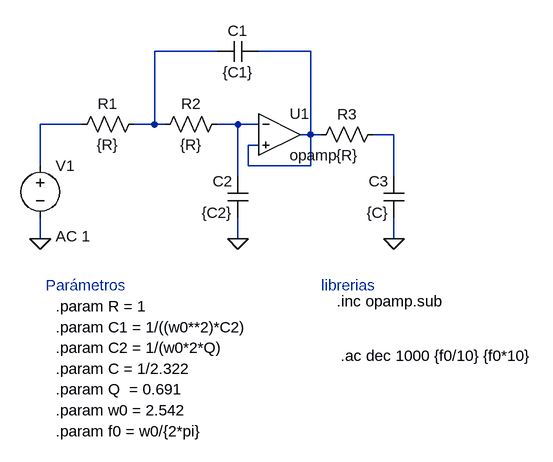
[diagram p0: schematic Draft2.asc]
Draft2.asc, the LTspice schematic file:
Version 4
SHEET 1 880 680
WIRE 192 32 96 32
WIRE 336 32 256 32
WIRE -16 144 -80 144
WIRE 96 144 96 32
WIRE 96 144 64 144
WIRE 112 144 96 144
WIRE 224 144 192 144
WIRE 256 144 224 144
WIRE 336 160 336 32
WIRE 336 160 320 160
WIRE 352 160 336 160
WIRE 464 160 432 160
WIRE 256 176 240 176
WIRE -80 208 -80 144
WIRE 240 208 240 176
WIRE 336 208 336 160
WIRE 336 208 240 208
WIRE 224 224 224 144
WIRE 464 224 464 160
WIRE -80 320 -80 288
WIRE 224 320 224 288
WIRE 464 320 464 288
FLAG -80 320 0
FLAG 224 320 0
FLAG 464 320 0
SYMBOL OpAmps\\opamp 288 96 R0
SYMATTR InstName U1
SYMBOL res 80 128 R90
WINDOW 0 0 56 VBottom 2
WINDOW 3 32 56 VTop 2
SYMATTR InstName R1
SYMATTR Value {R}
SYMBOL res 208 128 R90
WINDOW 0 0 56 VBottom 2
WINDOW 3 32 56 VTop 2
SYMATTR InstName R2
SYMATTR Value {R}
SYMBOL cap 256 16 R90
WINDOW 0 0 32 VBottom 2
WINDOW 3 32 32 VTop 2
SYMATTR InstName C1
SYMATTR Value {C1}
SYMBOL cap 240 288 R180
WINDOW 0 24 56 Left 2
WINDOW 3 24 8 Left 2
SYMATTR InstName C2
SYMATTR Value {C2}
SYMBOL cap 480 288 R180
WINDOW 0 24 56 Left 2
WINDOW 3 24 8 Left 2
SYMATTR InstName C3
SYMATTR Value {C}
SYMBOL res 448 144 R90
WINDOW 0 0 56 VBottom 2
WINDOW 3 32 56 VTop 2
SYMATTR InstName R3
SYMATTR Value {R}
SYMBOL voltage -80 192 R0
WINDOW 123 24 124 Left 2
WINDOW 39 0 0 Left 0
SYMATTR InstName V1
SYMATTR Value ""
SYMATTR Value2 AC 1
TEXT -72 392 Left 2 ;Parámetros
TEXT -56 424 Left 2 !.param R = 1
TEXT -56 456 Left 2 !.param C1 = 1/((w0**2)*C2)
TEXT -56 488 Left 2 !.param C2 = 1/(w0*2*Q)
TEXT -56 520 Left 2 !.param C = 1/2.322
TEXT 382 500 Left 2 !.ac dec 1000 {f0/10} {f0*10}
TEXT 352 392 Left 2 ;librerias
TEXT 376 416 Left 2 !.inc opamp.sub
TEXT -56 552 Left 2 !.param Q  = 0.691
TEXT -56 584 Left 2 !.param w0 = 2.542
TEXT -56 616 Left 2 !.param f0 = w0/{2*pi}

The netlist it stands for:
* Draft2.asc
XU1 N004 N002 N002 opamp Aol=100K GBW=10Meg  ; pins invin noninvin out
R1 N001 N003 {R}
R2 N004 N001 {R}
C1 N002 N001 {C1}
C2 0 N004 {C2}
C3 0 N005 {C}
R3 N005 N002 {R}
V1 N003 0 AC 1
* Parámetros
.param R = 1
.param C1 = 1/((w0**2)*C2)
.param C2 = 1/(w0*2*Q)
.param C = 1/2.322
.ac dec 1000 {f0/10} {f0*10}
* librerias
.inc opamp.sub
.param Q  = 0.691
.param w0 = 2.542
.param f0 = w0/{2*pi}
.backanno
.end